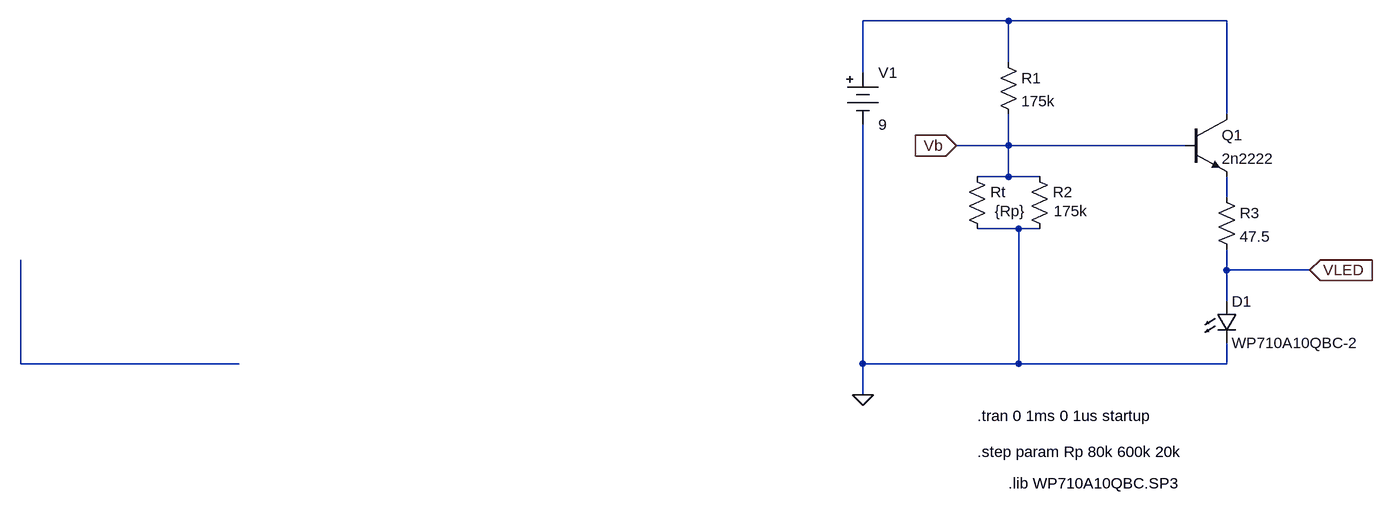
[diagram p0: schematic Untitled.asc]
Untitled.asc, the LTspice schematic file:
Version 4
SHEET 1 1140 904
WIRE 160 176 -64 176
WIRE 496 176 160 176
WIRE 160 240 160 176
WIRE -64 256 -64 176
WIRE 496 320 496 176
WIRE 160 368 160 320
WIRE 160 368 80 368
WIRE 432 368 160 368
WIRE 160 416 160 368
WIRE 160 416 112 416
WIRE 208 416 160 416
WIRE 496 448 496 416
WIRE 176 496 112 496
WIRE 208 496 176 496
WIRE 496 560 496 528
WIRE 624 560 496 560
WIRE 496 608 496 560
WIRE -1360 704 -1360 544
WIRE -1024 704 -1360 704
WIRE -64 704 -64 336
WIRE 176 704 176 496
WIRE 176 704 -64 704
WIRE 496 704 496 672
WIRE 496 704 176 704
WIRE -64 752 -64 704
FLAG -64 752 0
FLAG 80 368 Vb
IOPIN 80 368 In
FLAG 624 560 VLED
IOPIN 624 560 In
SYMBOL Misc/battery -64 240 R0
SYMATTR InstName V1
SYMATTR Value 9
SYMBOL res 144 224 R0
SYMATTR InstName R1
SYMATTR Value 175k
SYMBOL res 192 400 R0
WINDOW 3 38 69 Left 2
SYMATTR Value 175k
SYMATTR InstName R2
SYMBOL res 480 432 R0
SYMATTR InstName R3
SYMATTR Value 47.5
SYMBOL res 96 400 R0
WINDOW 3 43 69 Left 2
SYMATTR Value {Rp}
SYMATTR InstName Rt
SYMBOL npn 432 320 R0
SYMATTR InstName Q1
SYMATTR Value 2n2222
SYMBOL LED 480 608 R0
SYMATTR InstName D1
SYMATTR Value WP710A10QBC-2
TEXT 112 784 Left 2 !.tran 0 1ms 0 1us startup
TEXT 112 840 Left 2 !.step param Rp 80k 600k 20k
TEXT 160 888 Left 2 !.lib WP710A10QBC.SP3

The netlist it stands for:
* Untitled.asc
V1 N001 0 9
R1 N001 Vb 175k
R2 Vb 0 175k
R3 N002 VLED 47.5
Rt Vb 0 {Rp}
Q1 N001 Vb N002 0 2n2222
D1 VLED 0 WP710A10QBC-2
.model D D
.lib standard.dio
.model NPN NPN
.model PNP PNP
.lib standard.bjt
.tran 0 1ms 0 1us startup
.step param Rp 80k 600k 20k
.lib WP710A10QBC.SP3
.backanno
.end